# Altium schematic sheet Schematic_Interface_Lio.SchDoc: Schematic Interface Lio
size A3; Date: 18.07.2017; DrawnBy: Yan Gridling; Organization: HTW Chur; Address1: Pulvermühlestrasse 57; Address2: 7004 Chur; Address3: Switzerland; DocumentNumber: 1; Revision: V1.0; SheetNumber: 1; SheetTotal: 1; DocumentName: HTW Template
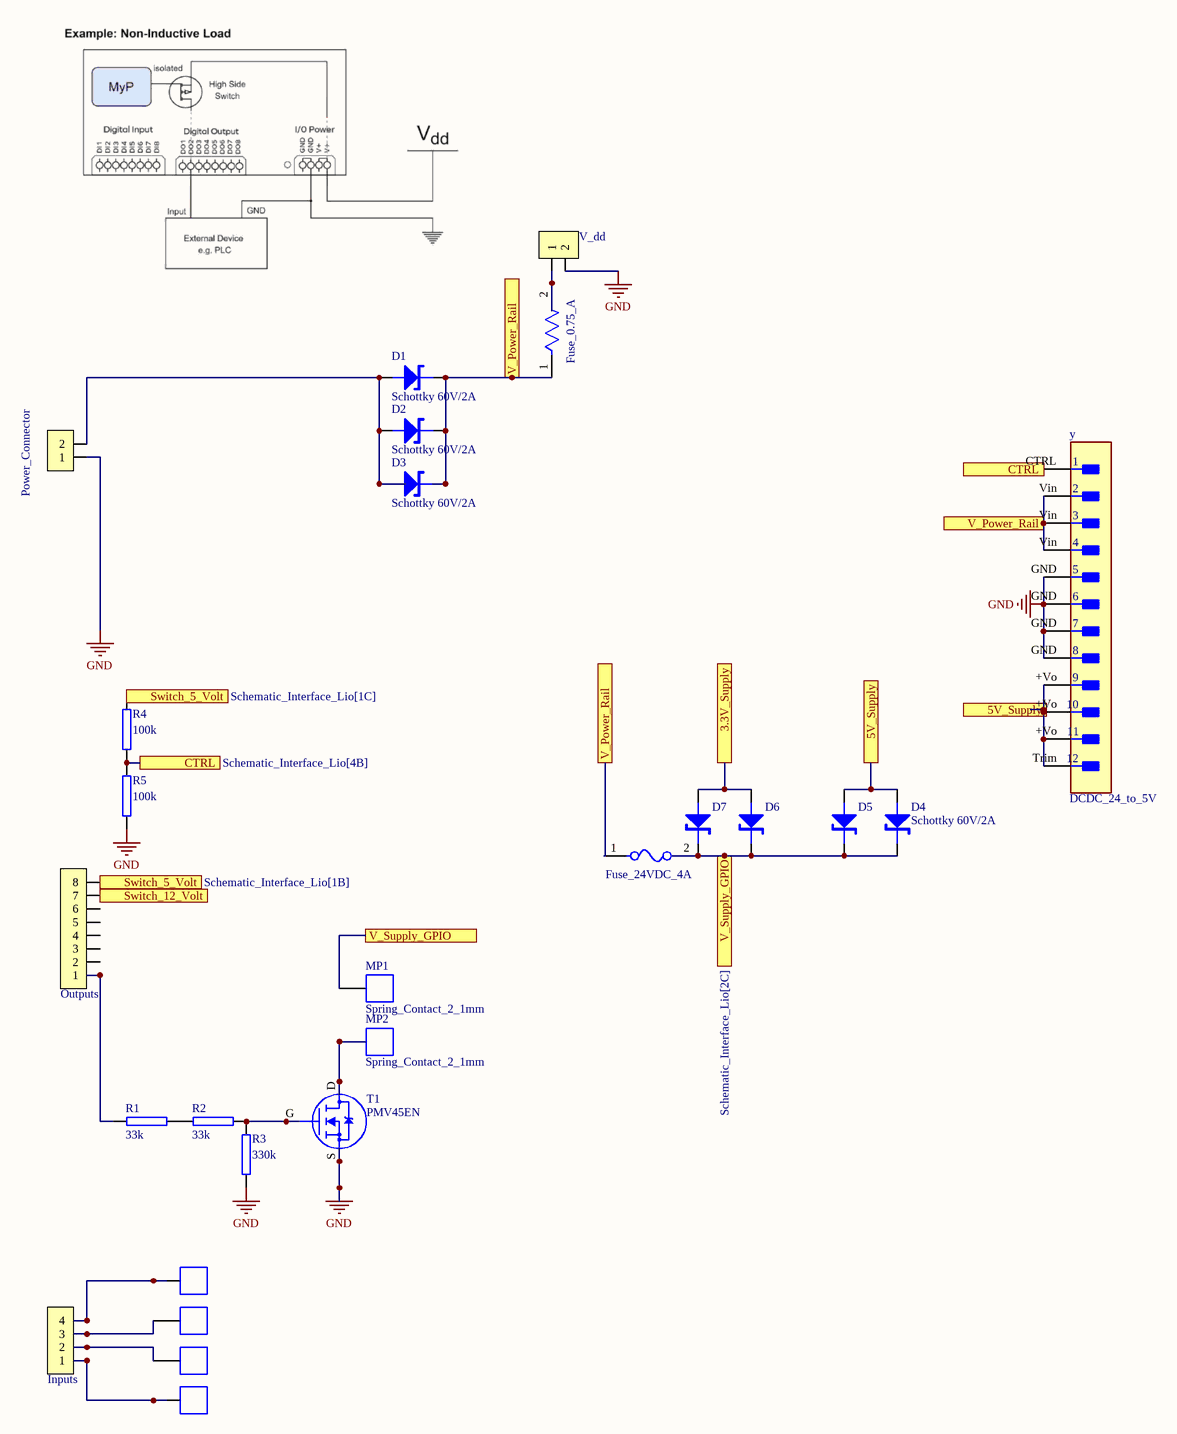
[diagram p0: Schematic_Interface_Lio.SchDoc]

## Parts
(Parts that share a designator on the sheet are numbered #1, #2 ... from top to bottom, then left to right.)
D1  Schottky 60V/2A  [SOD-123FL]
D2  Schottky 60V/2A  [SOD-123FL]
D3  Schottky 60V/2A  [SOD-123FL]
D4  Schottky 60V/2A  [SOD-123FL]
D5  Schottky 60V/2A  [SOD-123FL]  (value not drawn)
D6  Schottky 60V/2A  [SOD-123FL]  (value not drawn)
D7  Schottky 60V/2A  [SOD-123FL]  (value not drawn)
Fuse_0.75_A  Chip_Size_1206  [FP-CRCW1206-e3-IPC_A]  (value not drawn)
Fuse_24VDC_4A  Chip Size 2920  [FP-2920L-MFG]  (value not drawn)
Inputs  4Pin_Male  [Header1x4_254]  (value not drawn)
MP1  Spring_Contact_2_1mm  [331031321515]
MP2  Spring_Contact_2_1mm  [331031321515]
MP?#1  Spring_Contact_2_1mm  [331031321515]  (value not drawn)
MP?#2  Spring_Contact_2_1mm  [331031321515]  (value not drawn)
MP?#3  Spring_Contact_2_1mm  [331031321515]  (value not drawn)
MP?#4  Spring_Contact_2_1mm  [331031321515]  (value not drawn)
Outputs  8Pin_Male  [Header1x8_254]  (value not drawn)
Power_Connector  2Pin_Male  [Header1x2_254]  (value not drawn)
R1  value 33k  [0805]  (hidden comment: R 33K 0805)
R2  value 33k  [0805]  (hidden comment: R 33K 0805)
R3  value 330k  [0805]  (hidden comment: R 330K 0805)
R4  value 100k  [0805]  (hidden comment: R 100K 0805)
R5  value 100k  [0805]  (hidden comment: R 100K 0805)
T1  PMV45EN  [SOT-23-FET]
V_dd  2Pin_Male  [Header1x2_254]  (value not drawn)
y  DCDC_24_to_5V  [FP-90121-0772-MFG]

## Ports
3.3V_Supply, 5V_Supply (see Schematic_Interface_Lio[4B]), 5V_Supply (see Schematic_Interface_Lio[4C]), CTRL (see Schematic_Interface_Lio[1C]), CTRL (see Schematic_Interface_Lio[4B]), Switch_5_Volt (see Schematic_Interface_Lio[1B]), Switch_5_Volt (see Schematic_Interface_Lio[1C]), Switch_12_Volt, V_Power_Rail (see Schematic_Interface_Lio[3B], Schematic_Interface_Lio[3C]), V_Power_Rail (see Schematic_Interface_Lio[3B], Schematic_Interface_Lio[4B]), V_Power_Rail (see Schematic_Interface_Lio[3C], Schematic_Interface_Lio[4B]), V_Supply_GPIO (see Schematic_Interface_Lio[2C]), V_Supply_GPIO (see Schematic_Interface_Lio[3C])

## Nets
GND: Power_Connector.1 R3.2 R5.1 T1.S V_dd.2 y.GND
3.3V_Supply: D6.A D7.A ; port 3.3V_Supply
5V_Supply: D4.A D5.A ; port 5V_Supply
CTRL: R4.1 R5.2 y.CTRL ; port CTRL
Switch_5_Volt: Outputs.8 R4.2 ; port Switch_5_Volt
Switch_12_Volt: Outputs.7 ; port Switch_12_Volt
V_Power_Rail: D1.K D2.K D3.K Fuse_0.75_A.1 Fuse_24VDC_4A.1 y.Vin ; port V_Power_Rail
V_Supply_GPIO: D4.K D5.K D6.K D7.K Fuse_24VDC_4A.2 MP1.1 ; port V_Supply_GPIO
NetD1_A: D1.A D2.A D3.A Power_Connector.2
NetFuse_0.75_A_2: Fuse_0.75_A.2 V_dd.1
NetInputs_1: Inputs.1 MP?#4.1
NetInputs_2: Inputs.2 MP?#3.1
NetInputs_3: Inputs.3 MP?#2.1
NetInputs_4: Inputs.4 MP?#1.1
NetMP2_1: MP2.1 T1.D
NetOutputs_1: Outputs.1 R1.1
NetR1_2: R1.2 R2.1
NetR2_2: R2.2 R3.1 T1.G
Nety_+Vo: y.+Vo y.Trim

Not connected (* = marked no-connect by the designer): Outputs 2 3 4 5 6

## Notes on the sheet
- Drawn by:
- Title:
- Date:
- Sheet
- of
- Size:
- Revision:
- A3
- File:

## Library data of the parts
D1-D7 = D_NTS260ESF: Voltage: 60V; Current: 2A; Forward Voltage: 550mV@2A; Part ID: D_NTS260ESF; Price 10pcs: 0.364; Supplier 1: Digi-Key; ComponentLink1Description: Datasheet; ComponentLink1URL: https://www.onsemi.com/pub/Collateral/NTS260ESF-D.PDF; Supplier Part Number 1: RBR2MM60CTR-ND
Fuse_0.75_A = CMP-009-00177-1: SMD Chip Resistor, 100 Ohm, ± 1%, 250 mW, 1206 [3216 Metric], Thick Film, General Purpose
Fuse_24VDC_4A = CMP-005-00014-1: Fuse, Resettable, PTC, 16V, POLYFUSE SURF MOUNT, 2920 5.00A
Inputs = Header_4: Part ID: Header_4; Price 1pc (CHF): 0.16; Supplier 1: Digi-Key; ComponentLink1Description: Datasheet; ComponentLink1URL: https://www.we-online.com/katalog/datasheet/6130xx11121.pdf; Supplier Part Number 1: 732-5317-ND
MP1 MP2 MP?#1-MP?#4 = CMP-00028-00008-1: WE-SECF SMT EMI Contact Finger
Outputs = ArduinoConnector_8: Part ID: ArduinoConnector_8; Price 1pc (CHF): 0.36; Supplier 1: Digi-Key; ComponentLink1Description: Datasheet; ComponentLink1URL: https://katalog.we-online.de/em/datasheet/6130xx11121.pdf; Supplier Part Number 1: 732-5321-ND
Power_Connector V_dd = Header_2: Part ID: Header_2; Price 1pc (CHF): 0.13; Supplier 1: Digi-Key; ComponentLink1Description: Datasheet; ComponentLink1URL: https://katalog.we-online.de/em/datasheet/6130xx11121.pdf; Supplier Part Number 1: 732-5315-ND
R1 R2 = R_33k_0805: Tolerance: 1%; Power Dissipation: 125mW; Part ID: R_33k_0805; Price 10pcs (CHF): 0.042; Supplier 1: Digi-Key; Supplier Part Number 1: 311-33.0KCRCT-ND
R3 = R_330k_0805: Tolerance: 1%; Power Dissipation: 125mW; Part ID: R_330k_0805; Price 10pcs (CHF): 0.042; Supplier 1: Digi-Key; Supplier Part Number 1: 311-330KCRCT-ND
R4 R5 = R_100k_0805: Tolerance: 1%; Power Dissipation: 125mW; Part ID: R_100k_0805; Price 10pcs (CHF): 0.042; Supplier 1: Digi-Key; Supplier Part Number 1: 311-100KCRCT-ND
T1 = FET_N_CH_PMV45EN: Voltage: 30V; Current: 4.1A; Power Dissipation: 510mW; Part ID: FET_N_CH_PMV45EN; Price 1pc (CHF): 0.44; ComponentLink1URL: https://assets.nexperia.com/documents/data-sheet/PMV45EN2.pdf; ComponentLink1Description: Datasheet; Supplier 1: Digi-Key; Supplier Part Number 1: 1727-2307-1-ND
y = CMP-001-0000-1: Conn Unshrouded Header HDR 12 POS 2.54mm Solder RA Thru-Hole C-Grid III™ Frame